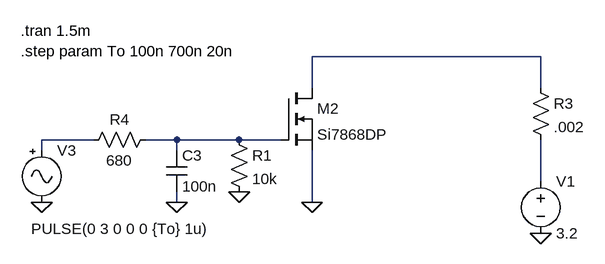
[diagram p0: schematic discharge.asc]
discharge.asc, the LTspice schematic file:
Version 4
SHEET 1 880 680
WIRE 496 64 144 64
WIRE 144 112 144 64
WIRE 496 112 496 64
WIRE -192 192 -272 192
WIRE -64 192 -112 192
WIRE 32 192 -64 192
WIRE 96 192 32 192
WIRE -272 208 -272 192
WIRE -64 208 -64 192
WIRE 496 256 496 192
WIRE -64 288 -64 272
WIRE 144 288 144 208
FLAG -272 288 0
FLAG 496 336 0
FLAG 144 288 0
FLAG -64 288 0
FLAG 32 272 0
SYMBOL voltage 496 240 R0
WINDOW 123 0 0 Left 0
WINDOW 39 0 0 Left 0
SYMATTR InstName V1
SYMATTR Value 3.2
SYMBOL Misc\\signal -272 192 R0
WINDOW 123 0 0 Left 0
WINDOW 39 0 0 Left 0
WINDOW 3 -16 137 Left 2
SYMATTR Value PULSE(0 3 0 0 0 {To} 1u)
SYMATTR InstName V3
SYMBOL nmos 96 112 R0
SYMATTR InstName M2
SYMATTR Value Si7868DP
SYMBOL res 480 96 R0
SYMATTR InstName R3
SYMATTR Value .002
SYMBOL res -96 176 R90
WINDOW 0 0 56 VBottom 2
WINDOW 3 32 56 VTop 2
SYMATTR InstName R4
SYMATTR Value 680
SYMBOL cap -80 208 R0
SYMATTR InstName C3
SYMATTR Value 100n
SYMBOL res 16 176 R0
SYMATTR InstName R1
SYMATTR Value 10k
TEXT -304 24 Left 2 !.tran 1.5m\n.step param To 100n 700n 20n

The netlist it stands for:
* discharge.asc
V1 N004 0 3.2
V3 N002 0 PULSE(0 3 0 0 0 {To} 1u)
M2 N001 N003 0 0 Si7868DP
R3 N001 N004 .002
R4 N003 N002 680
C3 N003 0 100n
R1 N003 0 10k
.model NMOS NMOS
.model PMOS PMOS
.lib standard.mos
.tran 1.5m
.step param To 100n 700n 20n
.backanno
.end